# EAGLE design vusbtiny (EAGLE 5.12)
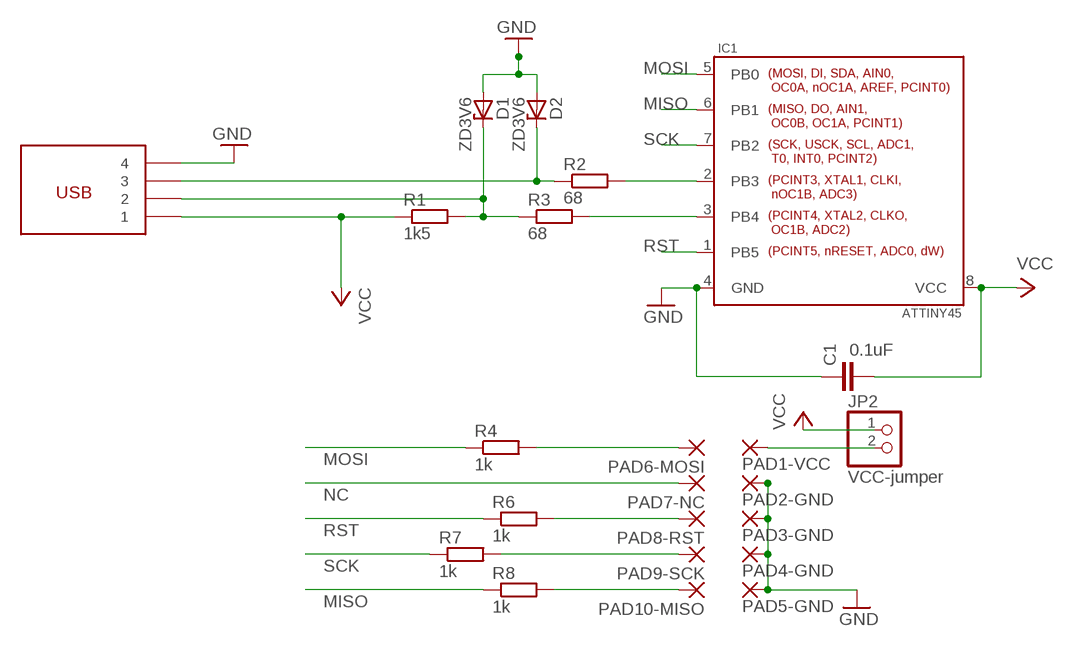
[diagram p0: schematic, sheet 1]

## Parts
C1  0.1uF  C2.5/2  [C2.5-2]
D1  ZD3V6  [DO35-7]
D2  ZD3V6  [DO35-7]
IC1  ATTINY45  [DIL08]
JP2  VCC-jumper  PINHD-1X2  [1X02]
PAD1-VCC  WIREPADSMD1,27-254  [SMD1,27-2,54]
PAD2-GND  WIREPADSMD1,27-254  [SMD1,27-2,54]
PAD3-GND  WIREPADSMD1,27-254  [SMD1,27-2,54]
PAD4-GND  WIREPADSMD1,27-254  [SMD1,27-2,54]
PAD5-GND  WIREPADSMD1,27-254  [SMD1,27-2,54]
PAD6-MOSI  WIREPADSMD1,27-254  [SMD1,27-2,54]
PAD7-NC  WIREPADSMD1,27-254  [SMD1,27-2,54]
PAD8-RST  WIREPADSMD1,27-254  [SMD1,27-2,54]
PAD9-SCK  WIREPADSMD1,27-254  [SMD1,27-2,54]
PAD10-MISO  WIREPADSMD1,27-254  [SMD1,27-2,54]
R1  1k5  R0309/10  [0309/10]
R2  68  R0309/10  [0309/10]
R3  68  R0309/10  [0309/10]
R4  1k  R0309/10  [0309/10]
R6  1k  R0309/10  [0309/10]
R7  1k  R0309/10  [0309/10]
R8  1k  R0309/10  [0309/10]
U$1  USB_A_EDGE  [USB_A_EDGE]

## Nets
GND: C1.1 D1.A D2.A IC1.4(GND) PAD2-GND.1(P) PAD3-GND.1(P) PAD4-GND.1(P) PAD5-GND.1(P) U$1.P$3
MISO: IC1.6(PB1) R8.1
MOSI: IC1.5(PB0) R4.1
N$1: IC1.3(PB4) R3.2
N$2: IC1.2(PB3) R2.2
N$3: D1.C R1.2 R3.1 U$1.P$2
N$4: JP2.2 PAD1-VCC.1(P)
N$5: PAD6-MOSI.1(P) R4.2
N$6: D2.C R2.1 U$1.P$1
N$7: PAD8-RST.1(P) R6.2
N$8: PAD9-SCK.1(P) R7.2
N$9: PAD10-MISO.1(P) R8.2
NC: PAD7-NC.1(P)
RST: IC1.1(PB5) R6.1
SCK: IC1.7(PB2) R7.1
VCC: C1.2 IC1.8(VCC) JP2.1 R1.1 U$1.P$4

## Library data of the parts
C1 = capacitor-wima:C: CAPACITOR naming: grid - package width
D1 D2 = vusbtiny:ZD3V6: Z DIODE (3.6 V, low power)
IC1 = mp_prog:ATTINY45: ATTINY45
JP2 = vusbtiny:PINHD-1X2: PIN HEADER
PAD1-VCC PAD2-GND PAD3-GND PAD4-GND PAD5-GND PAD6-MOSI PAD7-NC PAD8-RST PAD9-SCK PAD10-MISO = wirepad:WIREPAD: Wire PAD connect wire on PCB
R1-R4 R6-R8 = mp_passive:R: RESISTOR, European symbol
U$1 = vusbtiny:USB_A_EDGE

## Board
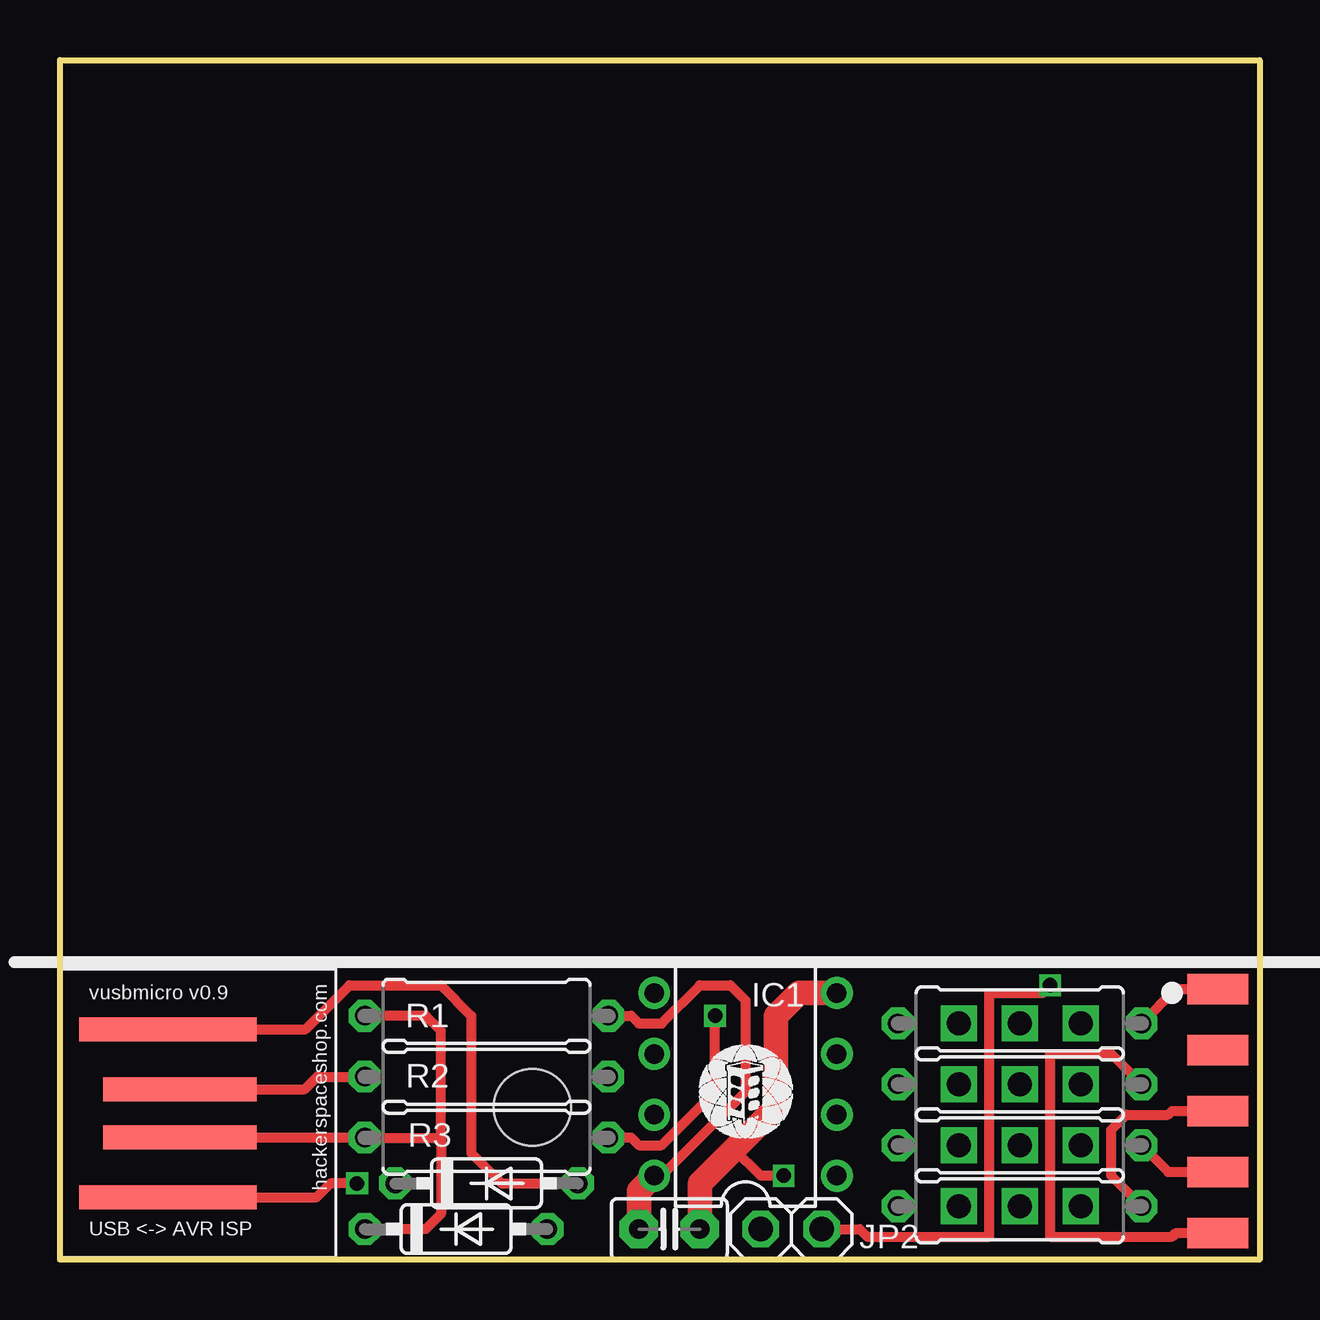
[diagram p1: board, top side]
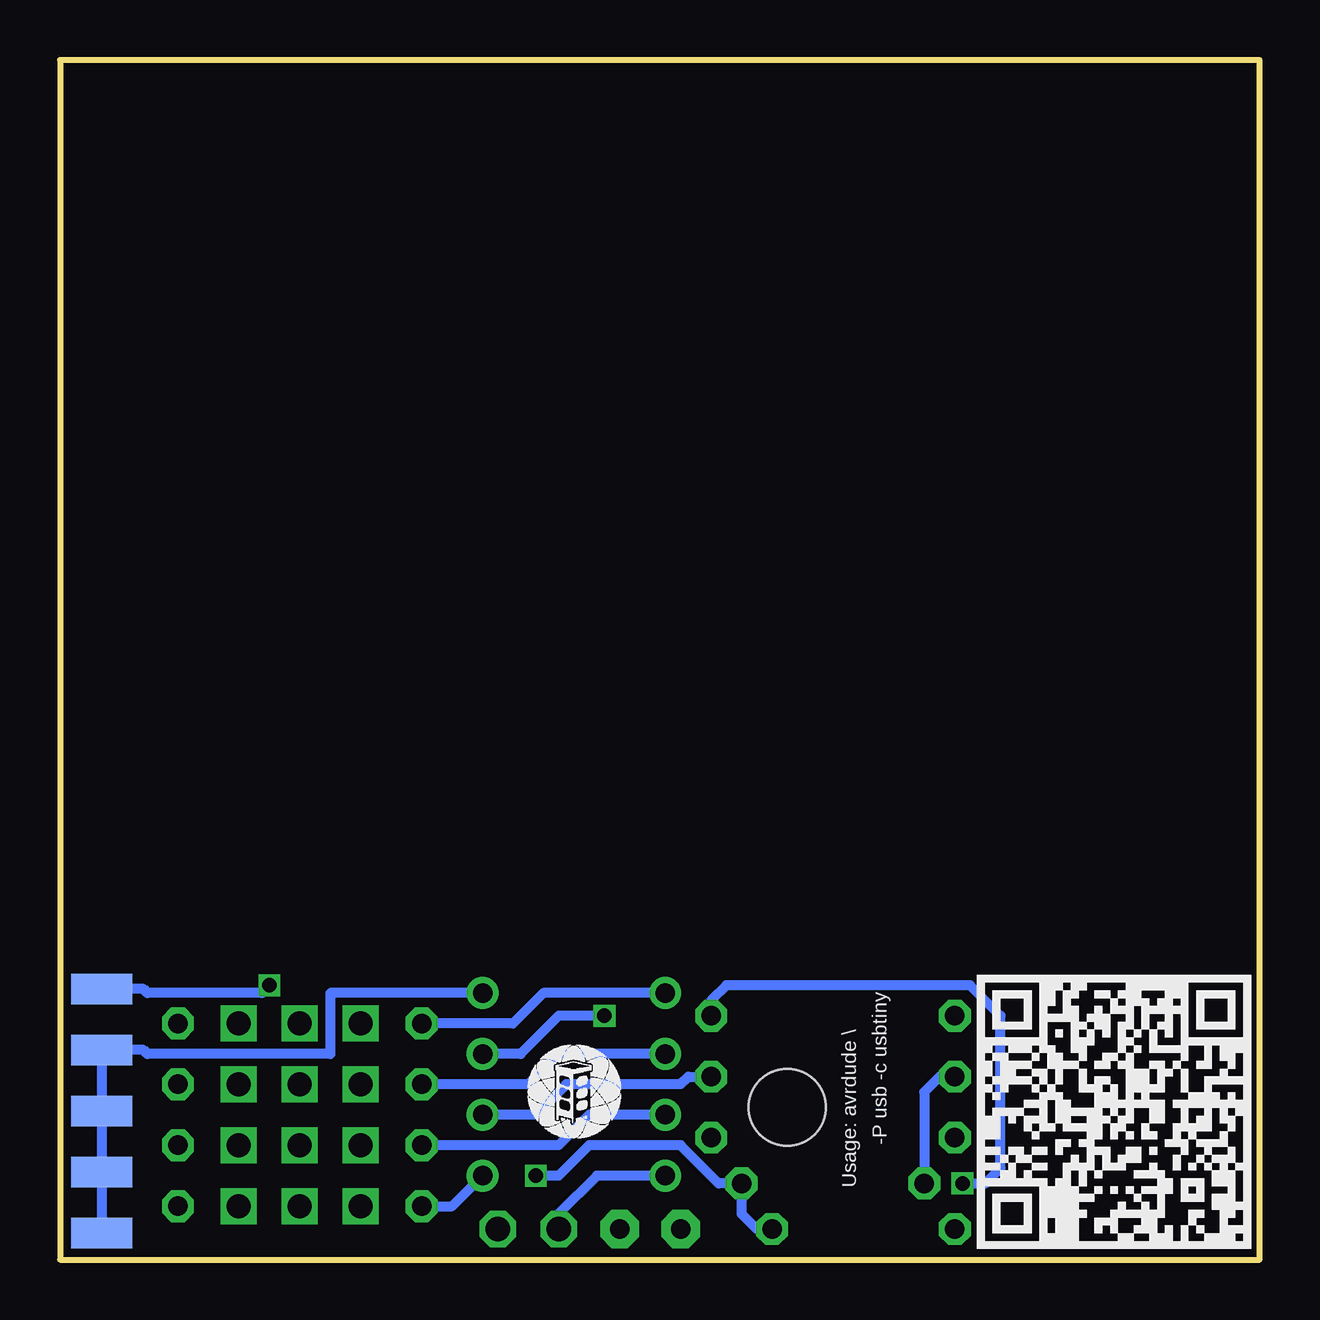
[diagram p2: board, bottom side, seen from below]

Size 50 x 50 mm. Coordinates in mm from the lower left corner, seen from the top.
Outline: 0,50 50,50 50,0 0,0 0,50
Copper layers (1*16): Top 0.035mm / dielectric 1.5mm / Bottom 0.035mm
Design rules "Fusion_eagle_rule_v1.1 *": minimum track width 6mil, minimum drill 12mil, track to track 6mil, track to pad 6mil, pad to pad 6mil, via to via 6mil, smd to smd 0mil, copper to edge 10mil, drill to drill 10mil, minimum pad ring 10mil, minimum via ring 6mil, stop-mask expansion 2mil, vias tented up to drill 100mil, thermal gap 10mil
Holes 3.2 mm at 19.68,6.35

### Footprints (pad centres in the part's own frame; a part is rotated, then mirrored left to right if it is on the bottom)
C2.5-2 = drill 0.813 pad 1.6 octagon: 1 -1.27,0; 2 1.27,0
DO35-7 = drill 0.813 octagon: A 3.81,0; C -3.81,0
DIL08 = drill 0.813 round: 1 -3.81,-3.81; 2 -1.27,-3.81; 3 1.27,-3.81; 4 3.81,-3.81; 5 3.81,3.81; 6 1.27,3.81; 7 -1.27,3.81; 8 -3.81,3.81
1X02 = drill 1.016 octagon: 1 -1.27,0; 2 1.27,0
SMD1,27-2,54 = smd 1.27 x 2.54: 1 0,0
0309/10 = drill 0.813 octagon: 1 -5.08,0; 2 5.08,0
USB_A_EDGE = smd 6.41 x 1: P$1 0,1; P$2 0,-1 | smd 7.41 x 1: P$3 -0.5,3.5; P$4 -0.5,-3.5

### Placement (x,y rotation side)
C1  25.4,1.27 180 top
D1  16.51,1.27 0 top
D2  17.78,3.17 0 top
IC1  28.57,7.3 90 top
JP2  30.48,1.27 0 top
PAD1-VCC  48.26,11.27 90 bottom
PAD2-GND  48.26,8.73 90 bottom
PAD3-GND  48.26,6.19 90 bottom
PAD4-GND  48.26,3.65 90 bottom
PAD5-GND  48.26,1.11 90 bottom
PAD6-MOSI  48.26,11.27 90 top
PAD7-NC  48.26,8.73 90 top
PAD8-RST  48.26,6.19 90 top
PAD9-SCK  48.26,3.65 90 top
PAD10-MISO  48.26,1.11 90 top
R1  17.78,10.16 180 top
R2  17.78,7.62 0 top
R3  17.78,5.08 0 top
R4  40.01,9.84 0 top
R6  40.01,2.22 0 top
R7  40.01,4.76 0 top
R8  40.01,7.3 0 top
U$1  5,6.1 0 top
U$2  [METALAB_SMALL]  28.57,6.99 0 top
U$3  [QR]  11.75,0.48 0 bottom
U$4  [METALAB_SMALL]  28.57,6.99 0 bottom

### Tracks (layer width: path | path; a pad name or v marks a point on that pad's centre or on a via)
GND  (via drill 0.6)
  Top 0.406: D2.A 18.41,3.17 17.14,4.45 17.14,10.16 15.88,11.43 12.06,11.43 10.23,9.6 U$1.P$3 | v30.16,3.49 29.21,3.49 28.1,4.6
  Top 1.016: C1.1 26.67,3.17 28.1,4.6 29.84,6.35 29.84,10.16 30.8,11.11 IC1.4
  Bottom 0.406: PAD5-GND.1 PAD4-GND.1 PAD3-GND.1 PAD2-GND.1 46.51,8.73 46.35,8.57 38.73,8.57 38.73,11.11 IC1.4 | D1.A 20.95,1.27 21.59,1.91 D2.A 22.54,3.17 24.13,4.76 27.94,4.76 29.21,3.49 v30.16,3.49
MISO
  Bottom 0.406: IC1.6 29.21,8.57 30.48,7.3 R8.1
MOSI
  Bottom 0.406: IC1.5 29.84,11.11 31.11,9.84 R4.1
N$1  (via drill 0.6)
  Top 0.406: v27.3,10.16 27.3,6.99 25.08,4.76 24.13,4.76 23.81,5.08 R3.2
  Bottom 0.406: IC1.3 30.8,8.57 29.21,10.16 v27.3,10.16
N$2
  Bottom 0.406: R2.2 23.81,7.62 24.13,7.3 28.89,7.3 30.16,6.03 IC1.2
N$3
  Top 0.406: R1.2 15.24,10.16 15.88,9.53 15.88,5.08 | D1.C 15.24,1.27 15.88,1.91 15.88,5.08 | 15.88,5.08 R3.1 12.68,5.1 U$1.P$2
N$4  (via drill 0.6)
  Top 0.406: JP2.2 33.34,1.27 33.66,0.95 38.73,0.95 38.73,11.11 40.96,11.11 v41.27,11.43
  Bottom 0.406: v41.27,11.43 41.59,11.11 46.35,11.11 46.51,11.27 PAD1-VCC.1
N$5
  Top 0.406: R4.2 46.51,11.27 PAD6-MOSI.1
N$6
  Top 0.406: R2.1 10.72,7.62 10.2,7.1 U$1.P$1
  Bottom 0.406: D2.C 13.97,6.99 13.34,7.62 R2.1
N$7
  Top 0.406: R6.2 43.81,3.49 43.81,5.4 44.45,6.03 46.2,6.03 46.35,6.19 PAD8-RST.1
N$8
  Top 0.406: R7.2 46.2,3.65 PAD9-SCK.1
N$9
  Top 0.406: R8.2 43.81,8.57 41.27,8.57 41.27,0.95 46.35,0.95 46.51,1.11 PAD10-MISO.1
N$10  (via drill 1)
  other vias: 40.01,9.84
N$11  (via drill 1)
  other vias: 42.55,7.3
N$12  (via drill 1)
  other vias: 40.01,4.76
N$13  (via drill 1)
  other vias: 42.55,2.22
N$14  (via drill 1)
  other vias: 42.55,9.84
N$15  (via drill 1)
  other vias: 37.47,9.84
N$16  (via drill 1)
  other vias: 37.47,7.3
N$17  (via drill 1)
  other vias: 40.01,7.3
N$18  (via drill 1)
  other vias: 42.55,4.76
N$19  (via drill 1)
  other vias: 37.47,4.76
N$20  (via drill 1)
  other vias: 37.47,2.22
N$21  (via drill 1)
  other vias: 40.01,2.22
RST
  Bottom 0.406: IC1.1 33.66,2.22 R6.1
SCK
  Bottom 0.406: IC1.7 27.94,6.03 29.21,4.76 R7.1
VCC  (via drill 0.6)
  Top 0.406: IC1.8 25.08,3.49 28.57,6.99 28.57,10.79 27.94,11.43 26.67,11.43 25.08,9.84 24.13,9.84 23.81,10.16 R1.1 | v12.38,3.17 11.28,3.17 10.7,2.6 U$1.P$4
  Top 1.016: C1.2 24.13,2.86 IC1.8
  Bottom 0.406: v12.38,3.17 11.43,3.17 10.79,3.81 10.79,10.16 12.06,11.43 22.23,11.43 22.86,10.79 R1.1 | JP2.1 29.21,1.91 27.62,3.49 IC1.8

### Text on the board
tPlace: vusbmicro v0.9 | hackerspaceshop.com | USB <-> AVR ISP
bPlace: -P usb -c usbtiny | Usage: avrdude \\
tValues: hackerspaceshop.com | vusbtiny++ 1.0